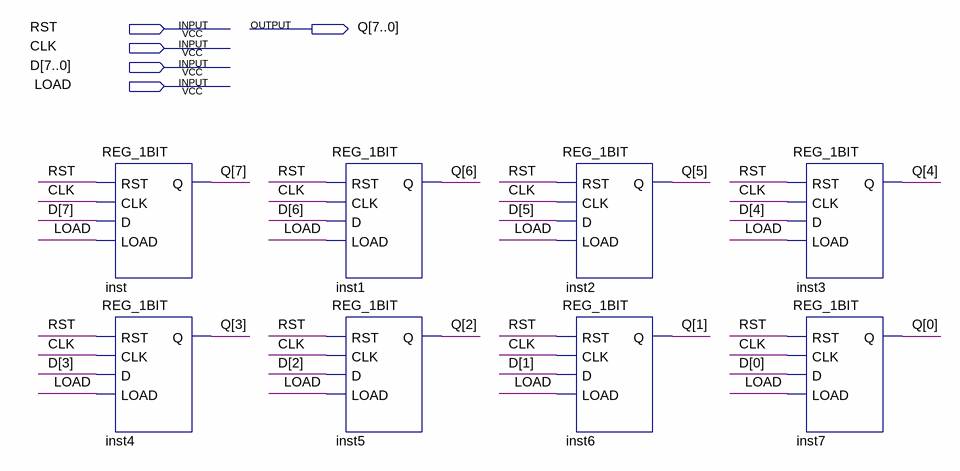
[diagram p0: schematic sheet]
// Quartus schematic REG_8BIT.bdf as structural Verilog: 8 symbols, 5 pins
module REG_8BIT (
  input  RST,
  input  CLK,
  input  [7:0] D,
  input  LOAD,
  output [7:0] Q
);

  REG_1BIT inst (.RST(RST), .CLK(CLK), .D(D[7]), .LOAD(LOAD), .Q(Q[7]));
  REG_1BIT inst4 (.RST(RST), .CLK(CLK), .D(D[3]), .LOAD(LOAD), .Q(Q[3]));
  REG_1BIT inst1 (.RST(RST), .CLK(CLK), .D(D[6]), .LOAD(LOAD), .Q(Q[6]));
  REG_1BIT inst5 (.RST(RST), .CLK(CLK), .D(D[2]), .LOAD(LOAD), .Q(Q[2]));
  REG_1BIT inst2 (.RST(RST), .CLK(CLK), .D(D[5]), .LOAD(LOAD), .Q(Q[5]));
  REG_1BIT inst6 (.RST(RST), .CLK(CLK), .D(D[1]), .LOAD(LOAD), .Q(Q[1]));
  REG_1BIT inst3 (.RST(RST), .CLK(CLK), .D(D[4]), .LOAD(LOAD), .Q(Q[4]));
  REG_1BIT inst7 (.RST(RST), .CLK(CLK), .D(D[0]), .LOAD(LOAD), .Q(Q[0]));
endmodule
